# EAGLE design PCB (EAGLE 9.6.0)
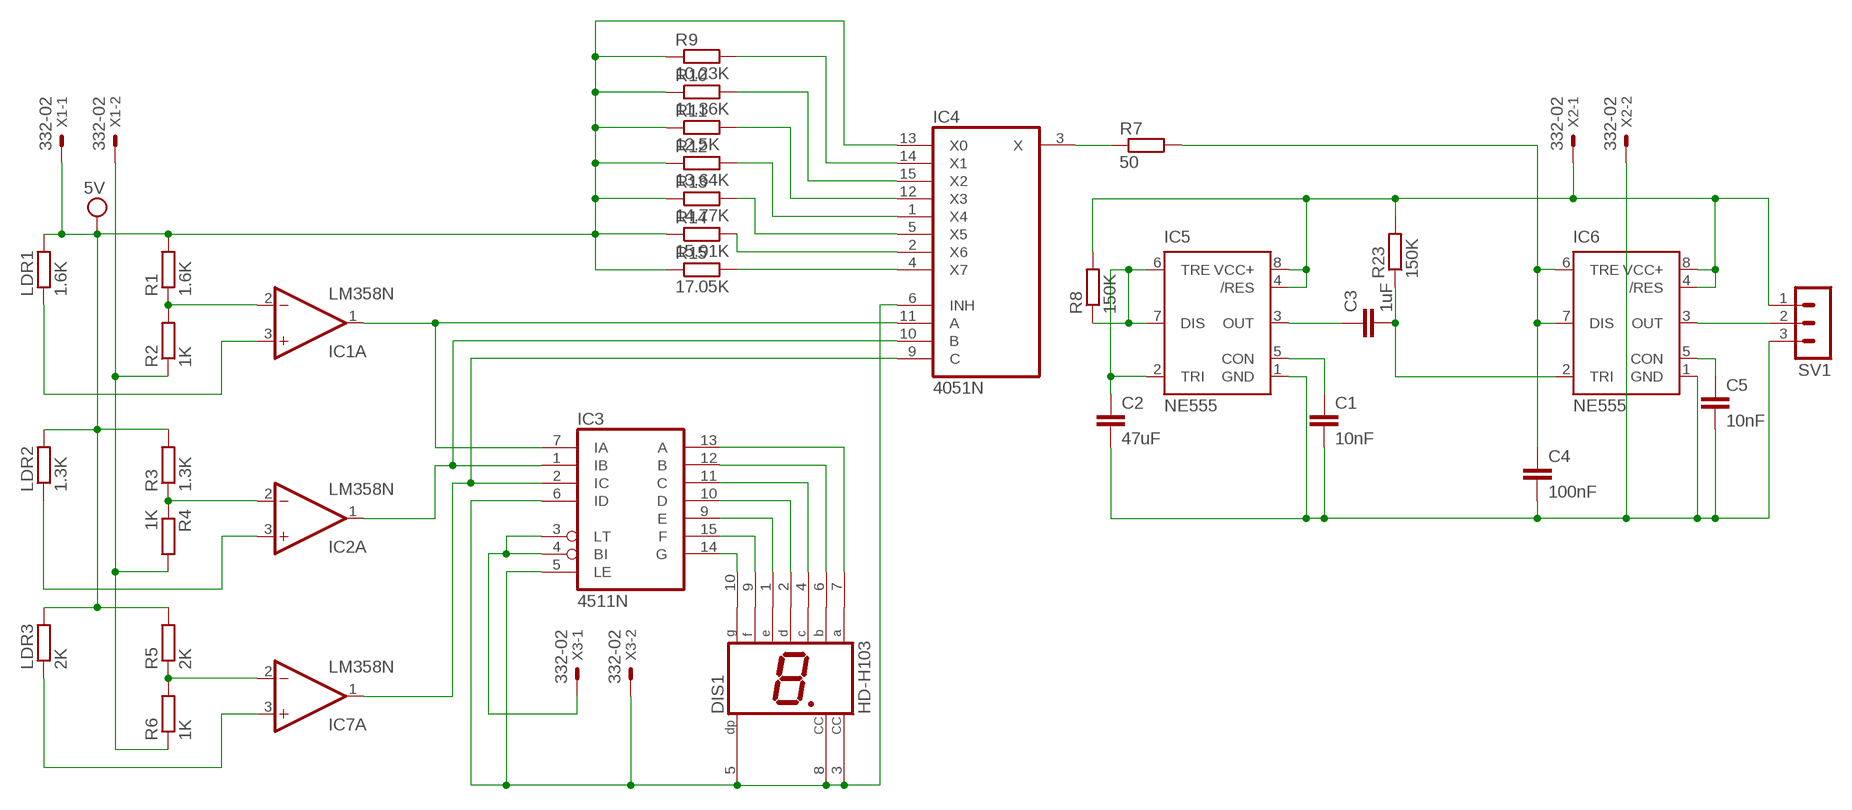
[diagram p0: schematic, sheet 1]

## Parts
C1  10nF  C2.5/2  [C2.5-2]
C2  47uF  C2.5/2  [C2.5-2]
C3  1uF  C2.5/2  [C2.5-2]
C4  100nF  C2.5/2  [C2.5-2]
C5  10nF  C2.5/2  [C2.5-2]
DIS1  HD-H103  [HDSP-M]
IC1  LM358N  [DIL08]
IC2  LM358N  [DIL08]
IC3  4511N  [DIL16]
IC4  4051N  [DIL16]
IC5  NE555  [DIL-08]
IC6  NE555  [DIL-08]
IC7  LM358N  [DIL08]
LDR1  1.6K  R-EU_0207/10  [0207/10]
LDR2  1.3K  R-EU_0207/10  [0207/10]
LDR3  2K  R-EU_0207/10  [0207/10]
R1  1.6K  R-EU_0207/10  [0207/10]
R2  1K  R-EU_0207/10  [0207/10]
R3  1.3K  R-EU_0207/10  [0207/10]
R4  1K  R-EU_0207/10  [0207/10]
R5  2K  R-EU_0207/10  [0207/10]
R6  1K  R-EU_0207/10  [0207/10]
R7  50  R-EU_0207/10  [0207/10]
R8  150K  R-EU_0207/10  [0207/10]
R9  10.23K  R-EU_0207/10  [0207/10]
R10  11.36K  R-EU_0207/10  [0207/10]
R11  12.5K  R-EU_0207/10  [0207/10]
R12  13.64K  R-EU_0207/10  [0207/10]
R13  14.77K  R-EU_0207/10  [0207/10]
R14  15.91K  R-EU_0207/10  [0207/10]
R15  17.05K  R-EU_0207/10  [0207/10]
R23  150K  R-EU_0207/10  [0207/10]
SV1  MA03-1  [MA03-1]
X1  332-02  [332-02]
X2  332-02  [332-02]
X3  332-02  [332-02]

## Nets
N$1: IC1.2(A:-IN) R1.1 R2.2
N$2: IC2.2(A:-IN) R3.1 R4.1
N$3: IC7.2(A:-IN) R5.1 R6.2
N$4: DIS1.10(G) IC3.14(G)
N$5: DIS1.9(F) IC3.15(F)
N$6: IC1.3(A:+IN) LDR1.1
N$7: IC2.3(A:+IN) LDR2.1
N$8: IC7.3(A:+IN) LDR3.1
N$9: IC1.1(A:OUT) IC3.7(IA) IC4.11(A)
N$10: IC2.1(A:OUT) IC3.1(IB) IC4.10(B)
N$11: IC3.2(IC) IC4.9(C) IC7.1(A:OUT)
N$12: IC4.4(X7) R15.2
N$13: DIS1.1(E) IC3.9(E)
N$14: DIS1.2(D) IC3.10(D)
N$15: DIS1.4(C) IC3.11(C)
N$16: DIS1.6(B) IC3.12(B)
N$17: DIS1.7(A) IC3.13(A)
N$18: DIS1.3(CC) DIS1.5(DP) DIS1.8(CC) IC3.5(LE) IC3.6(ID) IC4.6(INH) X3.2
N$19: IC4.2(X6) R14.2
N$20: IC4.5(X5) R13.2
N$21: IC4.1(X4) R12.2
N$22: IC4.12(X3) R11.2
N$23: IC4.15(X2) R10.2
N$24: IC4.14(X1) R9.2
N$25: IC4.3(X) R7.1
N$26: C1.1 IC5.5(CON)
N$27: C3.1 IC5.3(OUT)
N$28: C3.2 IC6.2(TRI) R23.1
N$29: C2.1 IC5.2(TRI) IC5.6(TRE) IC5.7(DIS) R8.1
N$30: C4.1 IC6.6(TRE) IC6.7(DIS) R7.2
N$31: C5.1 IC6.5(CON)
N$32: IC6.3(OUT) SV1.2
N$33: C1.2 C2.2 C4.2 C5.2 IC5.1(GND) IC6.1(GND) SV1.3 X2.2
N$34: IC3.3(LT) IC3.4(BI) X3.1
N$35: R2.1 R4.2 R6.1 X1.2
N$36: IC5.4(/RES) IC5.8(VCC+) IC6.4(/RES) IC6.8(VCC+) R8.2 R23.2 SV1.1 X2.1
VCC: IC4.13(X0) LDR1.2 LDR2.2 LDR3.2 R1.2 R3.2 R5.2 R9.1 R10.1 R11.1 R12.1 R13.1 R14.1 R15.1 X1.1 ; supply symbol labelled 5V
Unconnected: IC1.5(B:+IN) IC1.6(B:-IN) IC1.7(B:OUT) IC2.5(B:+IN) IC2.6(B:-IN) IC2.7(B:OUT) IC7.5(B:+IN) IC7.6(B:-IN) IC7.7(B:OUT)

## Power pins joined to a net without a drawn wire
GND: IC4.8(GND)
V+: IC1.8(P:V+) IC2.8(P:V+) IC7.8(P:V+)
V-: IC1.4(P:V-) IC2.4(P:V-) IC7.4(P:V-)
VCC: IC4.16(VCC)
VDD: IC3.16(VDD)
VEE: IC4.7(VEE)
VSS: IC3.8(VSS)

## Library data of the parts
C1-C5 = capacitor-wima:C: CAPACITOR naming: grid - package width
DIS1 = display-hp:HD-H103: LED DISPLAY 1-character 7 segment, decimal point right; OC_FARNELL: unknown; OC_NEWARK: unknown
IC1 IC2 IC7 = linear:LM358: OP AMP also LM158; LM258; LM2904 Source: http://cache.national.com/ds/LM/LM158.pdf
IC3 = 45xx:4511: BCD to 7-segment LATCH/DECODER/DRIVER
IC4 = 40xx:4051: 8-channel ANALOG MULTIPLEXER
IC5 IC6 = st-microelectronics:NE555: General purpose bipolar Timer; MF: Arrow Electronics; MPN: NE555N; OC_FARNELL: 1467742; OC_NEWARK: 89K1486
LDR1-LDR3 R1-R15 R23 = rcl:R-EU_: RESISTOR, European symbol; SPICEPREFIX: R
SV1 = con-lstb:MA03-1: PIN HEADER; OC_FARNELL: unknown; OC_NEWARK: unknown
X1-X3 = con-garry:332-02: 2 Pin - 2mm Dual Row Source: www.mpe-connector.de / garry_shortform_2012.pdf

## Net classes
0 default: clearance 0.205 mm

## Board
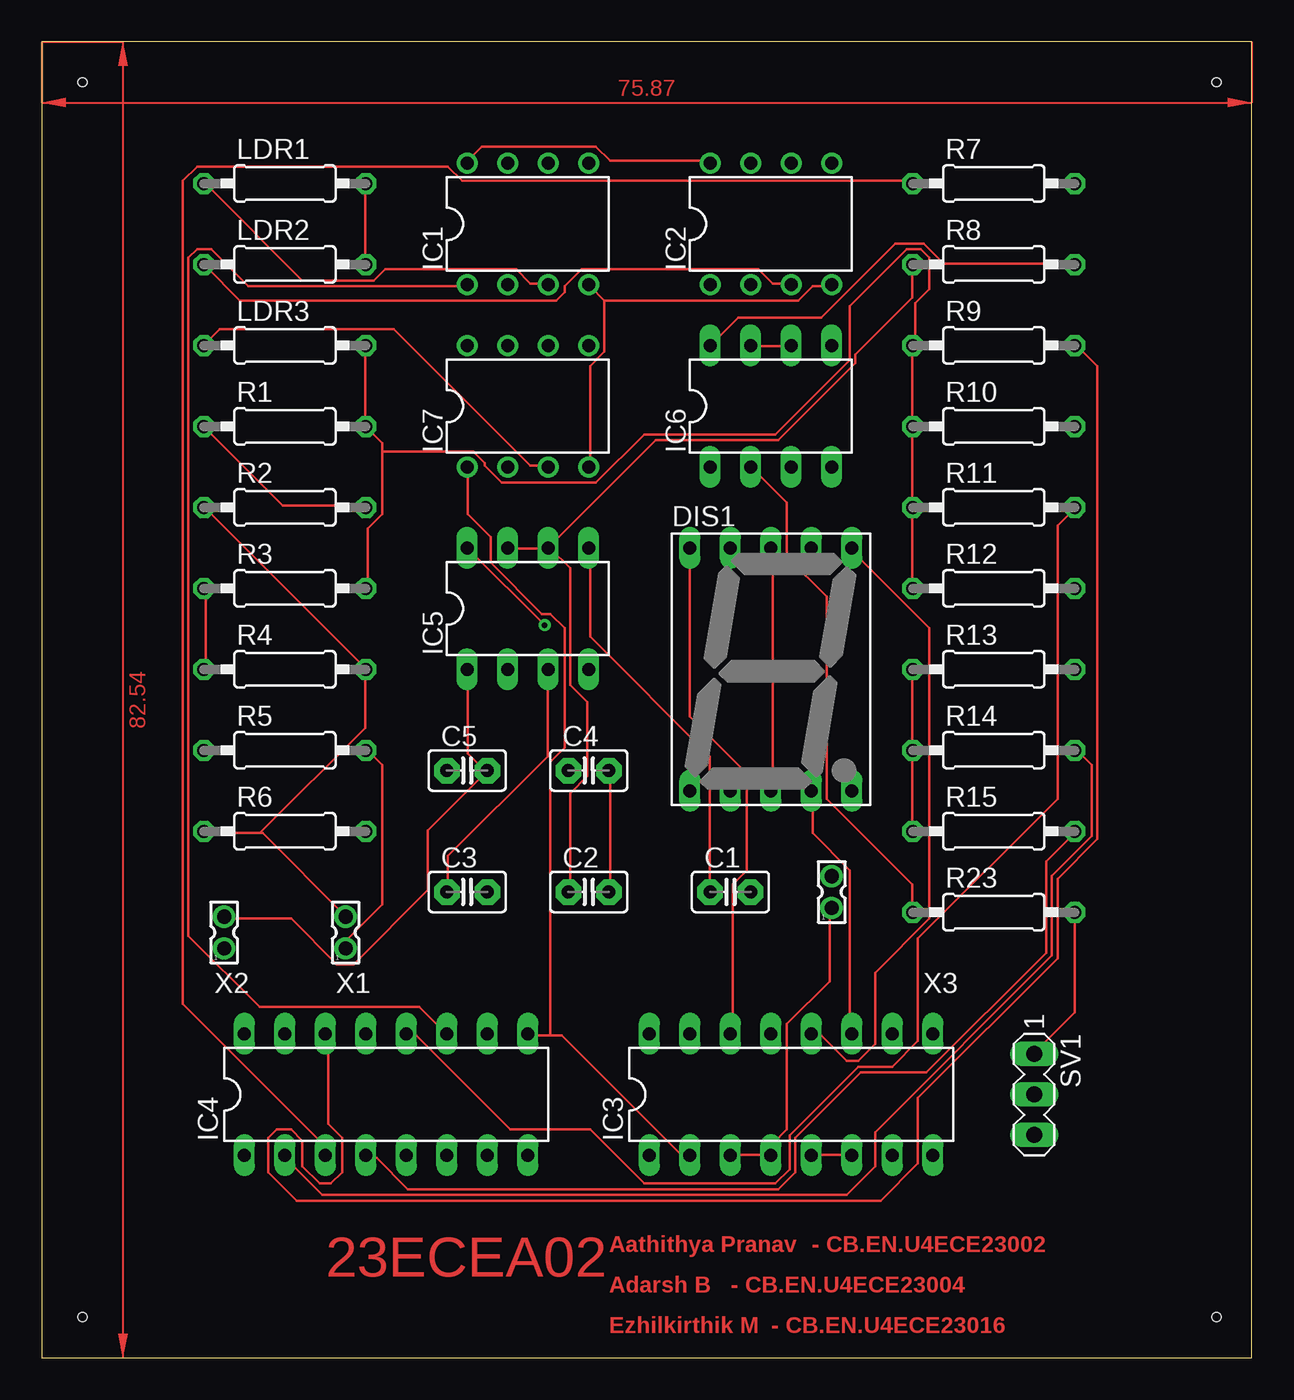
[diagram p1: board, top side]
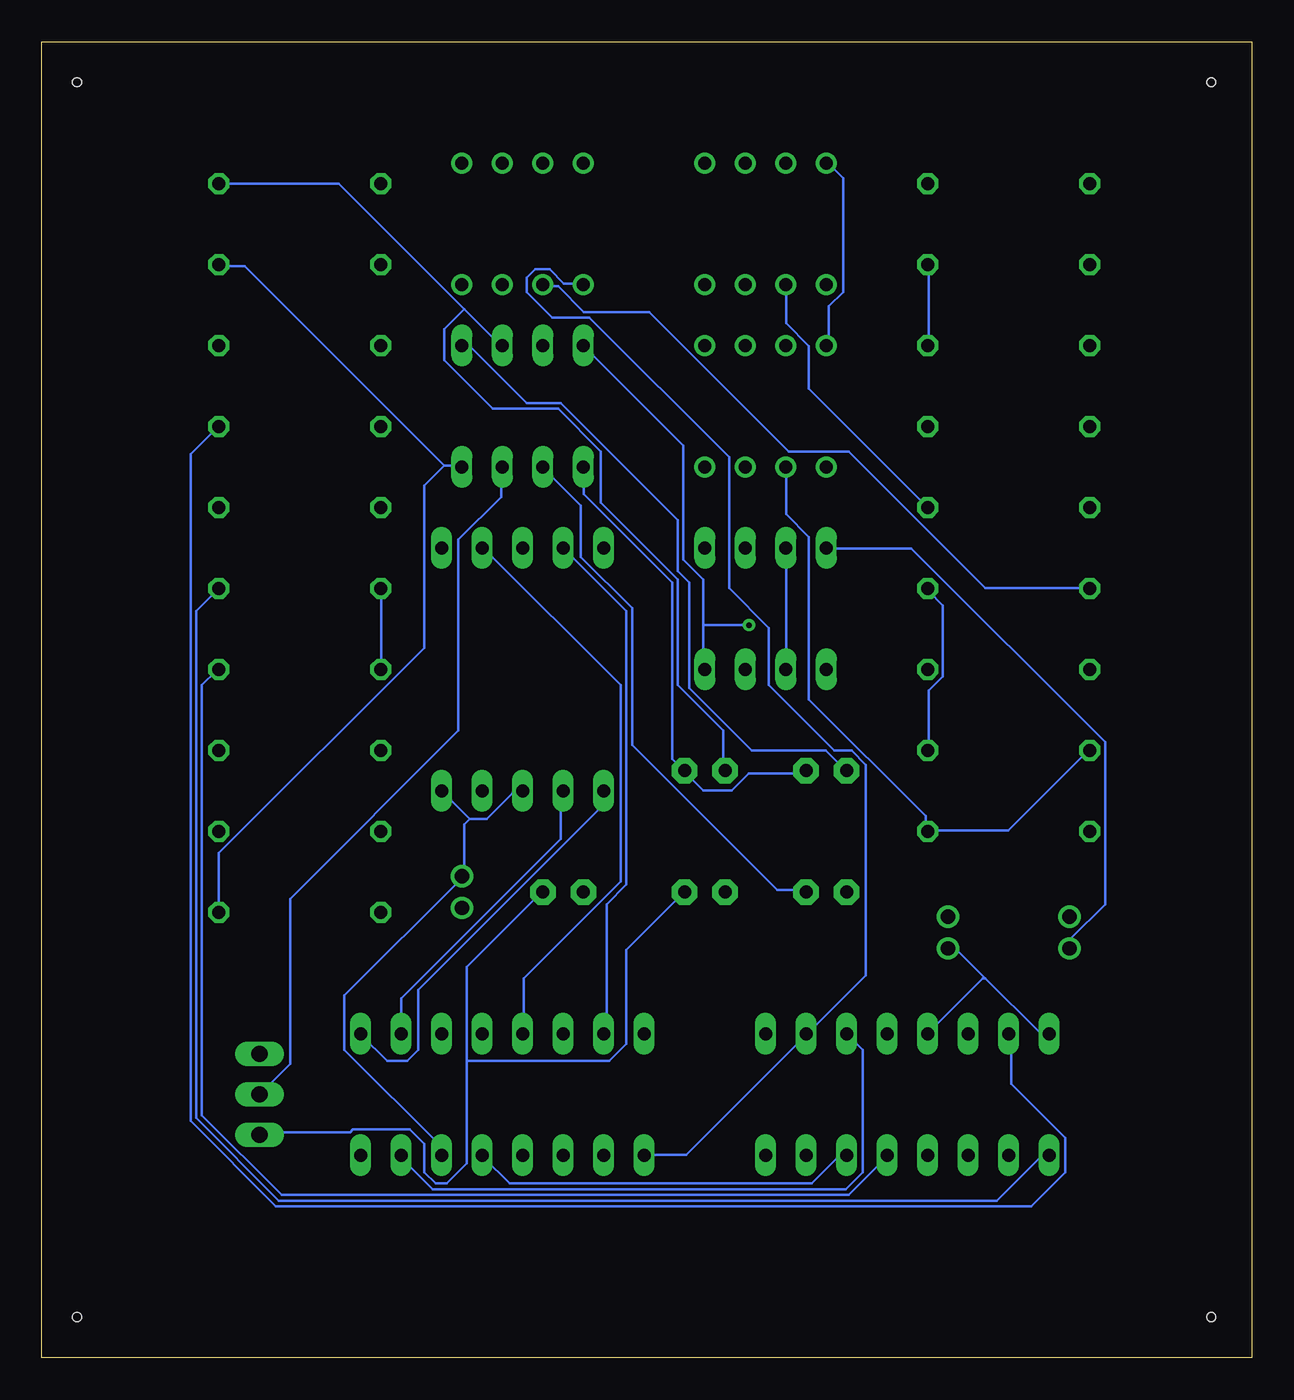
[diagram p2: board, bottom side, seen from below]

Size 75.87 x 82.54 mm. Coordinates in mm from the lower left corner, seen from the top.
Outline: 0,0 75.87,0 75.87,82.54 0,82.54 0,0
Copper layers (1*16): Top 0.035mm / dielectric 1.5mm / Bottom 0.035mm
Design rules "default": minimum track width 6mil, minimum drill 0.35mm, track to track 6mil, track to pad 6mil, pad to pad 6mil, via to via 6mil, smd to smd 6mil, copper to edge 40mil, drill to drill 6mil, minimum pad ring 10mil, minimum via ring 8mil, stop-mask expansion 4mil, vias tented up to drill 0mil, thermal gap 10mil
Holes 0.55 mm at 2.54,80.01 73.66,80.01 73.66,2.54 2.54,2.54

### Footprints (pad centres in the part's own frame; a part is rotated, then mirrored left to right if it is on the bottom)
C2.5-2 = drill 0.813 pad 1.6 octagon: 1 -1.27,0; 2 1.27,0
HDSP-M = drill 0.813 long: 1 -5.08,-7.62; 2 -2.54,-7.62; 3 0,-7.62; 4 2.54,-7.62; 5 5.08,-7.62; 6 5.08,7.62; 7 2.54,7.62; 8 0,7.62; 9 -2.54,7.62; 10 -5.08,7.62
DIL08 = drill 0.813 pad 1.27: 1 -3.81,-3.81; 2 -1.27,-3.81; 3 1.27,-3.81; 4 3.81,-3.81; 5 3.81,3.81; 6 1.27,3.81; 7 -1.27,3.81; 8 -3.81,3.81
DIL16 = drill 0.813 long: 1 -8.89,-3.81; 2 -6.35,-3.81; 3 -3.81,-3.81; 4 -1.27,-3.81; 5 1.27,-3.81; 6 3.81,-3.81; 7 6.35,-3.81; 8 8.89,-3.81; 9 8.89,3.81; 10 6.35,3.81; 11 3.81,3.81; 12 1.27,3.81; 13 -1.27,3.81; 14 -3.81,3.81; 15 -6.35,3.81; 16 -8.89,3.81
DIL-08 = drill 0.813 long: 1 -3.81,-3.81; 2 -1.27,-3.81; 3 1.27,-3.81; 4 3.81,-3.81; 5 3.81,3.81; 6 1.27,3.81; 7 -1.27,3.81; 8 -3.81,3.81
0207/10 = drill 0.813 octagon: 1 -5.08,0; 2 5.08,0
MA03-1 = drill 1.016 long: 1 -2.54,0; 2 0,0; 3 2.54,0
332-02 = drill 0.9 pad 1.27: 1 0,-1; 2 0,1

### Placement (x,y rotation side)
C1  43.18,29.21 0 top
C2  34.29,29.21 0 top
C3  26.67,29.21 0 top
C4  34.29,36.83 0 top
C5  26.67,36.83 0 top
DIS1  45.72,43.18 0 top
IC1  30.48,71.12 0 top
IC2  45.72,71.12 0 top
IC3  46.99,16.51 0 top
IC4  21.59,16.51 0 top
IC5  30.48,46.99 0 top
IC6  45.72,59.69 0 top
IC7  30.48,59.69 0 top
LDR1  15.24,73.66 0 top
LDR2  15.24,68.58 0 top
LDR3  15.24,63.5 0 top
R1  15.24,58.42 0 top
R2  15.24,53.34 0 top
R3  15.24,48.26 0 top
R4  15.24,43.18 0 top
R5  15.24,38.1 0 top
R6  15.24,33.02 0 top
R7  59.69,73.66 0 top
R8  59.69,68.58 0 top
R9  59.69,63.5 0 top
R10  59.69,58.42 0 top
R11  59.69,53.34 0 top
R12  59.69,48.26 0 top
R13  59.69,43.18 0 top
R14  59.69,38.1 0 top
R15  59.69,33.02 0 top
R23  59.69,27.94 0 top
SV1  62.23,16.51 270 top
X1  19.05,26.67 0 top
X2  11.43,26.67 0 top
X3  49.53,29.21 0 top

### Tracks (layer width: path | path; a pad name or v marks a point on that pad's centre or on a via)
N$1
  Top 0.152: R2.2 20.27,53.45 15.09,53.45 10.26,58.28 R1.1
  Bottom 0.152: IC1.2 29.2,67.21 29.2,64.89 27.77,63.46 27.77,60.78 20.45,53.45 R2.2
N$2
  Top 0.152: R4.1 10.26,43.27 10.26,48.09 R3.1
  Bottom 0.152: IC2.2 44.39,67.21 43.5,67.21 41.89,65.6 37.78,65.6 29.03,56.85 25.27,56.85 16.7,48.27 10.26,48.27 R3.1
N$3
  Bottom 0.152: R5.1 10.26,38.08 15.27,33.08 20.27,33.08 R6.2 20.45,33.08 20.45,33.97 27.77,41.3 27.77,51.49 29.2,52.91 29.2,55.77 IC7.2
N$4
  Top 0.152: DIS1.10 40.64,50.77 40.64,40.23 44.21,36.65 44.21,30.58 43.32,29.68 43.32,20.39 IC3.14
N$5
  Bottom 0.152: IC3.15 40.46,20.39 40.46,28.43 39.21,29.68 39.21,46.84 43.14,50.77 DIS1.9
N$6
  Top 0.152: IC1.3 31.71,67.39 30.63,67.39 29.74,68.28 21.52,68.28 20.81,67.57 16.34,67.57 10.26,73.64 LDR1.1
N$7
  Top 0.152: IC2.3 46.9,67.39 45.82,67.39 44.93,68.28 33.85,68.28 32.78,67.21 32.78,66.85 32.24,66.32 12.41,66.32 10.26,68.46 LDR2.1
N$8
  Top 0.152: IC7.3 31.71,55.95 30.63,55.95 22.06,64.53 11.16,64.53 10.26,63.64 LDR3.1
N$9
  Top 0.152: IC1.1 26.52,67.21 12.94,67.21 10.62,69.53 9.73,69.53 9.19,69 9.19,26.47 13.66,22 23.66,22 25.27,20.39 IC4.11
  Bottom 0.152: IC3.7 53.33,12.53 51.36,10.56 25.45,10.56 24.38,11.63 24.38,19.32 25.27,20.21 IC4.11
N$10
  Bottom 0.152: IC3.1 37.96,12.71 35.46,12.71 27.95,20.21 IC4.10 27.77,20.39 24.2,23.96 24.2,37.19 25.09,38.08 26.17,38.08 30.28,42.19 30.28,45.77 32.78,48.27 32.78,56.49 41.53,65.25 43.86,65.25 45.47,66.85 45.47,67.75 44.93,68.28 44.04,68.28 43.14,67.39 42.07,67.39 IC2.1
N$11
  Top 0.152: 31.88,20.21 30.63,20.21 IC4.9 | 31.88,20.21 32.6,20.21 40.1,12.71 40.46,12.71 IC3.2 | 31.88,20.21 31.88,37.37 32.78,38.26 32.78,45.77 31.88,46.66 31.35,46.66 28.13,49.88 28.13,51.49 26.7,52.91 26.7,55.77 IC7.1
N$12
  Top 0.152: IC4.4 20.45,12.53 20.98,12.53 22.95,10.56 46.18,10.56 47.25,11.63 47.25,13.78 51.36,17.89 55.47,17.89 62.98,25.39 62.98,31.11 64.77,32.9 R15.2
N$13
  Bottom 0.152: DIS1.1 40.64,35.4 40.64,34.69 52.26,23.07 52.26,19.32 52.97,18.6 54.22,18.6 55.83,20.21 IC3.9
N$14
  Bottom 0.152: DIS1.2 43.32,35.4 43.32,32.54 53.33,22.54 53.33,20.39 IC3.10
N$15
  Top 0.152: DIS1.4 48.32,35.4 48.32,32.9 50.65,30.58 50.65,20.39 IC3.11
N$16
  Top 0.152: IC3.12 48.32,20.21 48.86,20.21 50.47,18.6 51.18,18.6 52.26,19.68 52.26,24.14 55.65,27.54 55.65,45.77 50.65,50.77 DIS1.6
N$17
  Bottom 0.152: IC3.13 45.64,20.39 45.64,23.79 39.57,29.86 39.57,42.19 48.15,50.77 DIS1.7
N$18
  Top 0.152: IC3.6 50.65,12.71 48.32,12.71 IC3.5 | DIS1.8 45.82,50.77 45.82,35.58 DIS1.3
  Bottom 0.152: IC4.6 25.45,12.53 25.99,12.53 27.6,10.92 46.54,10.92 48.15,12.53 IC3.5 | 49.04,33.79 47.97,33.79 46.36,35.4 45.82,35.4 DIS1.3 | 49.04,33.79 50.65,35.4 DIS1.5 | 49.04,33.79 49.4,33.44 49.4,30.22 X3.2 49.58,30.04 56.9,22.71 56.9,19.32 50.83,13.24 50.83,12.71 IC3.6
N$19
  Top 0.152: IC4.2 15.27,12.53 17.59,10.21 50.47,10.21 52.26,11.99 52.26,14.14 63.34,25.22 63.34,30.22 65.84,32.72 65.84,37.19 64.94,38.08 R14.2
N$20
  Bottom 0.152: IC4.5 22.95,12.53 25.27,10.21 60.83,10.21 65.84,15.21 65.84,42.19 64.94,43.09 R13.2
N$21
  Bottom 0.152: IC4.1 12.76,12.53 13.3,12.53 15.98,9.85 61.01,9.85 66.2,15.03 66.2,46.84 64.94,48.09 R12.2
N$22
  Top 0.152: IC4.12 22.95,20.21 23.49,20.21 29.38,14.31 34.39,14.31 37.78,10.92 46,10.92 46.9,11.81 46.9,13.96 51.18,18.25 53.33,18.25 54.94,19.86 54.94,26.29 63.69,35.04 63.69,52.2 64.77,53.27 R11.2
N$23
  Bottom 0.152: IC4.15 15.09,20.21 15.09,17.17 11.69,13.78 11.69,11.63 13.84,9.49 61.19,9.49 66.55,14.85 66.55,56.67 64.94,58.28 R10.2
N$24
  Top 0.152: IC4.14 17.95,20.21 17.95,14.67 18.84,13.78 18.84,11.63 18.12,10.92 17.41,10.92 16.34,11.99 16.34,13.6 15.62,14.31 14.73,14.31 14.19,13.78 14.19,11.63 15.98,9.85 52.61,9.85 54.94,12.17 54.94,16.28 63.69,25.04 63.69,30.04 66.2,32.54 66.2,62.21 64.94,63.46 R9.2
N$25
  Top 0.152: IC4.3 17.77,12.71 17.77,13.24 8.83,22.18 8.83,73.82 9.73,74.72 25.45,74.72 26.34,73.82 54.58,73.82 R7.1
N$26
  Top 0.152: IC5.5 34.39,50.77 34.39,45.23 41.89,37.73 41.89,29.33 C1.1
N$27
  Top 0.152: IC5.3 31.71,43.09 31.71,37.73 25.45,31.47 25.45,29.33 C3.1
N$28
  Top 0.152: R23.1 54.58,28.07 54.58,29.68 49.22,35.04 49.22,47.73 46.72,50.23 46.72,53.63 44.57,55.77 IC6.2
  Bottom 0.152: C3.2 27.95,29.33 29.74,29.33 38.85,38.44 38.85,47.02 42.07,50.23 42.07,53.45 44.39,55.77 IC6.2
N$29
  Top 0.152: IC5.6 31.71,50.77 29.38,50.77 IC5.7 | R8.1 54.58,68.46 54.58,66.49 51.01,62.92 51.01,62.39 46.18,57.56 38.5,57.56 31.88,50.95 IC5.6 | C2.1 33.14,29.33 33.14,35.4 34.21,36.47 34.21,41.12 33.14,42.19 33.14,49.52 31.88,50.77 IC5.6
  Bottom 0.152: IC5.2 29.2,43.27 29.2,50.77 IC5.7
N$30
  Top 0.152: IC6.7 44.57,63.46 46.9,63.46 IC6.6
  Bottom 0.152: 49.4,65.78 47.07,63.46 IC6.6 | 49.4,65.78 57.26,73.64 64.77,73.64 R7.2 | 49.4,65.78 50.65,64.53 50.65,62.56 47.61,59.53 43.5,59.53 40.82,56.85 40.82,53.63 35.99,48.8 35.99,42.19 33.14,39.33 33.14,36.83 C4.1
N$31
  Bottom 0.152: IC6.5 49.4,63.46 49.04,63.46 45.47,59.88 43.32,59.88 35.99,52.56 35.99,49.34 35.28,48.62 35.28,42.01 31.35,38.08 26.7,38.08 25.45,36.83 C5.1
N$32
  Bottom 0.152: IC6.3 47.07,55.77 47.07,53.99 49.75,51.31 49.75,39.33 60.3,28.79 60.3,18.43 62.09,16.64 SV1.2
N$33
  Top 0.152: IC5.1 26.7,43.09 26.7,37.9 27.77,36.83 C5.2 27.77,36.65 24.2,33.08 24.2,29.33 19.55,24.68 18.48,24.68 15.62,27.54 11.51,27.54 X2.2 | C2.2 35.64,29.33 35.64,36.65 C4.2
  Bottom 0.152: 49.22,18.6 49.22,24.5 44.57,29.15 C1.2 | 49.22,18.6 49.22,12.17 50.47,10.92 51.18,10.92 51.9,11.63 51.9,13.42 52.79,14.31 56.37,14.31 56.55,14.14 62.09,14.14 SV1.3 | IC6.1 41.89,55.77 41.89,54.17 36.35,48.62 36.35,37.55 35.64,36.83 C4.2 35.46,36.65 34.39,35.58 32.6,35.58 31.53,36.65 27.95,36.65 C5.2 | 49.22,18.6 40.28,18.6 39.21,19.68 39.21,25.57 35.64,29.15 C2.2
N$34
  Top 0.152: IC3.3 43.32,12.71 45.64,12.71 IC3.4 45.82,12.71 45.82,13.42 46.72,14.31 46.72,20.93 49.4,23.61 49.4,28.07 X3.1
N$35
  Top 0.152: 13.66,32.9 13.84,32.9 19.02,27.72 X1.2 | 13.66,32.9 10.26,32.9 R6.1 | 13.66,32.9 20.27,39.51 20.27,43.09 R4.2 20.27,43.27 10.26,53.27 R2.1
N$36  (via drill 0.35)
  Top 0.152: R23.2 64.77,27.9 64.77,21.64 62.26,19.14 SV1.1 | v31.53,45.95 26.7,50.77 IC5.8 | R8.2 64.77,68.64 56.55,68.64 55.3,69.89 53.51,69.89 48.86,65.25 43.68,65.25 42.07,63.64 IC6.8
  Bottom 0.152: 50.65,55.95 49.58,55.95 IC6.4 | 50.65,55.95 63.16,68.46 64.77,68.46 R8.2 | 50.65,55.95 51.9,54.7 51.9,44.52 64.77,31.65 64.77,28.07 R23.2 | 34.39,45.95 34.39,48.8 35.64,50.05 35.64,57.2 41.89,63.46 IC6.8 | 34.39,45.95 34.39,43.27 IC5.4 | 34.39,45.95 v31.53,45.95 | X2.1 11.34,25.75 11.34,26.29 9.19,28.43 9.19,38.62 21.34,50.77 26.52,50.77 IC5.8
V+
  Top 0.152: IC2.8 41.89,75.07 35.64,75.07 34.74,75.97 27.6,75.97 26.7,75.07 IC1.8
  Bottom 0.152: IC7.8 26.52,63.64 26.52,65.96 25.63,66.85 25.63,74 26.52,74.89 IC1.8
V-
  Top 0.152: 35.28,66.32 35.28,63.1 34.39,62.21 34.39,55.95 IC7.4 | 35.28,66.32 34.39,67.21 IC1.4 | 35.28,66.32 47.43,66.32 48.32,67.21 49.4,67.21 IC2.4
VCC
  Top 0.152: R15.1 54.58,33.08 54.58,38.08 R14.1 54.58,38.26 54.58,43.09 R13.1 | R12.1 54.58,48.27 54.58,53.27 R11.1 54.58,53.45 54.58,58.28 R10.1 54.58,58.45 54.58,63.46 R9.1 54.76,63.64 54.76,66.14 55.65,67.03 55.65,69 55.12,69.53 54.22,69.53 50.65,65.96 50.65,62.56 46,57.92 37.78,57.92 34.74,54.88 28.85,54.88 27.77,55.95 27.77,56.13 27.06,56.85 21.34,56.85 | LDR3.2 20.27,63.46 20.27,58.45 R1.2 20.45,58.28 21.34,57.38 21.34,56.85 | LDR1.2 20.27,73.64 20.27,68.64 LDR2.2 | 21.34,56.85 21.34,52.91 20.45,52.02 20.45,48.27 R3.2 | X1.1 19.2,25.75 19.2,26.29 21.34,28.43 21.34,37.19 20.45,38.08 R5.2
  Bottom 0.152: R13.1 54.58,43.27 54.58,48.09 R12.1 | 16.7,23.79 18.48,25.57 19.02,25.57 X1.1 | 16.7,23.79 13.3,20.39 12.76,20.39 IC4.16 | 16.7,23.79 16.87,23.79 20.27,20.39 IC4.13 | R5.2 20.27,38.26 20.27,41.84 19.38,42.73 19.38,47.2 20.27,48.09 R3.2 | LDR2.2 20.27,68.46 20.27,63.64 LDR3.2
(copper drawn outside any net)
  shapes: Top area x2

### Text on the board
Top: Aathithya Pranav | - CB.EN.U4ECE23002 | 23ECEA02 | Adarsh B | - CB.EN.U4ECE23004 | Ezhilkirthik M | - CB.EN.U4ECE23016